# Altium schematic sheet 601_PCIe-USB.SchDoc: PCIE to USB Hub
size A2; Organization: Greenfield Tech Solutions; Address1: Molendreef 33; Address2: Ossendrecht; Address3: 4641CS; Address4: The Netherlands; SheetNumber: 7; SheetTotal: 8
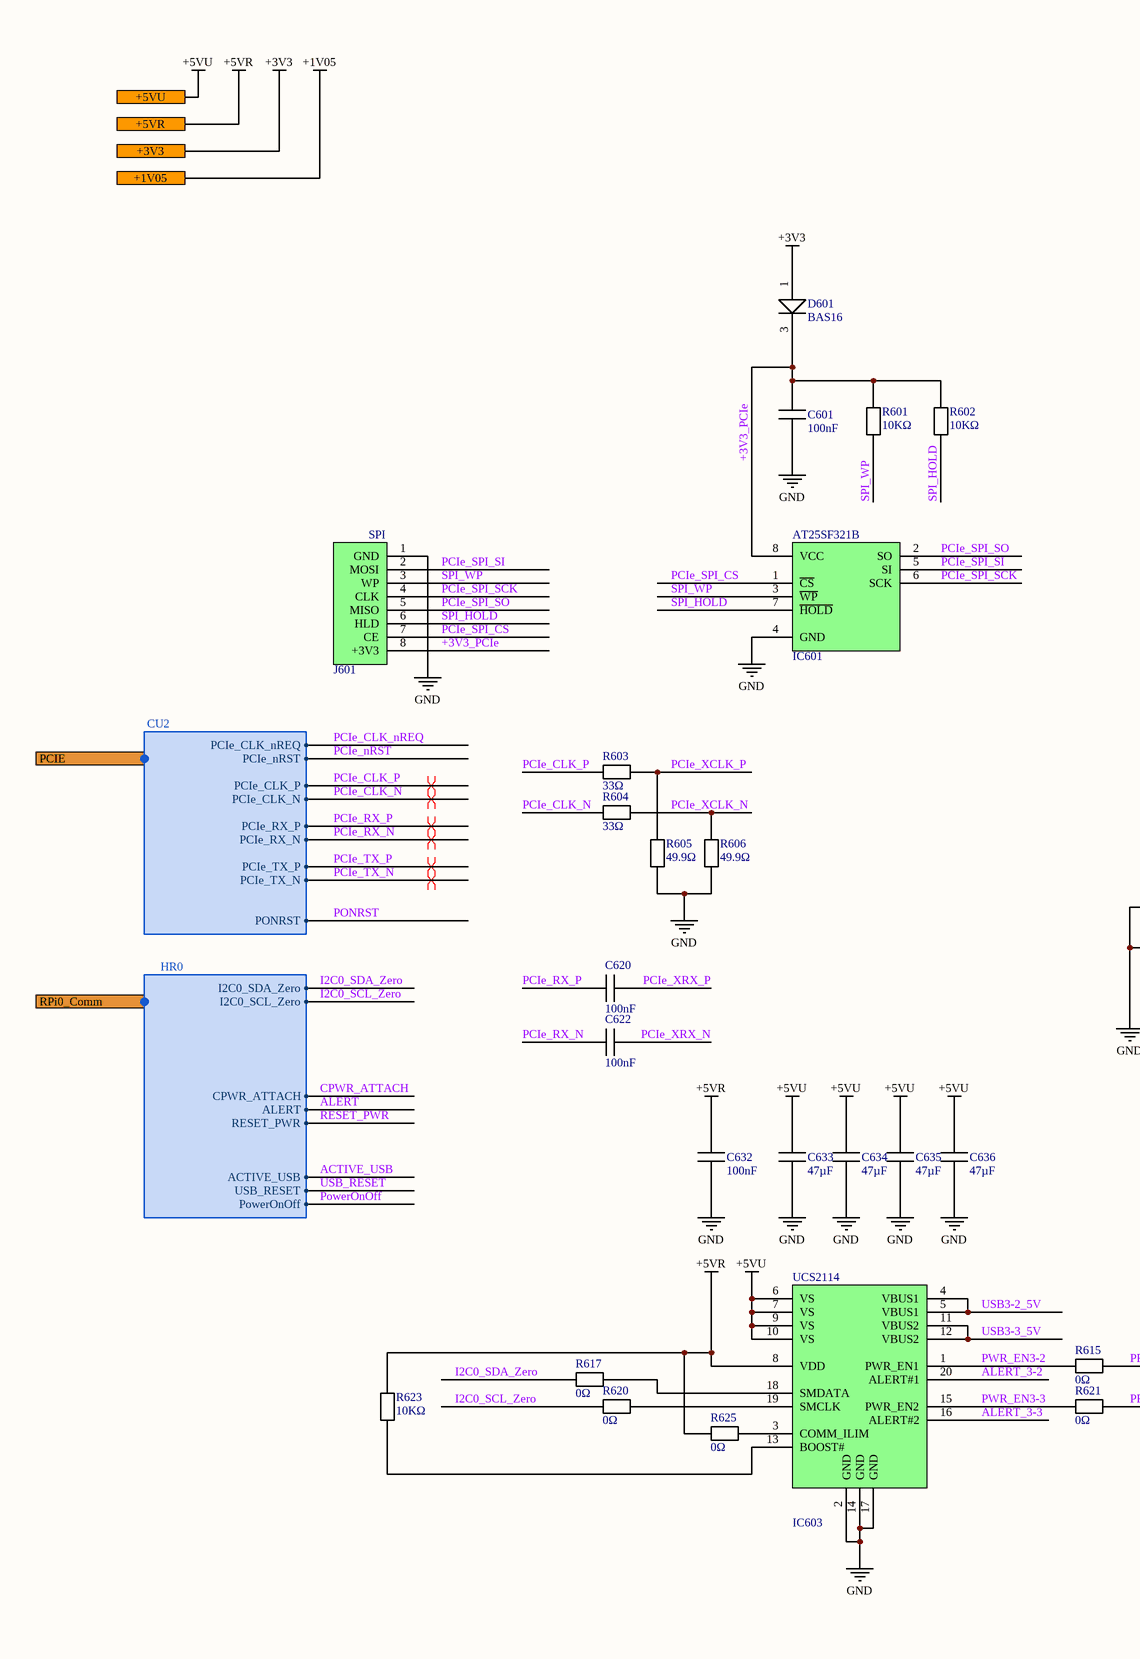
[diagram p0: 601_PCIe-USB.SchDoc, left]
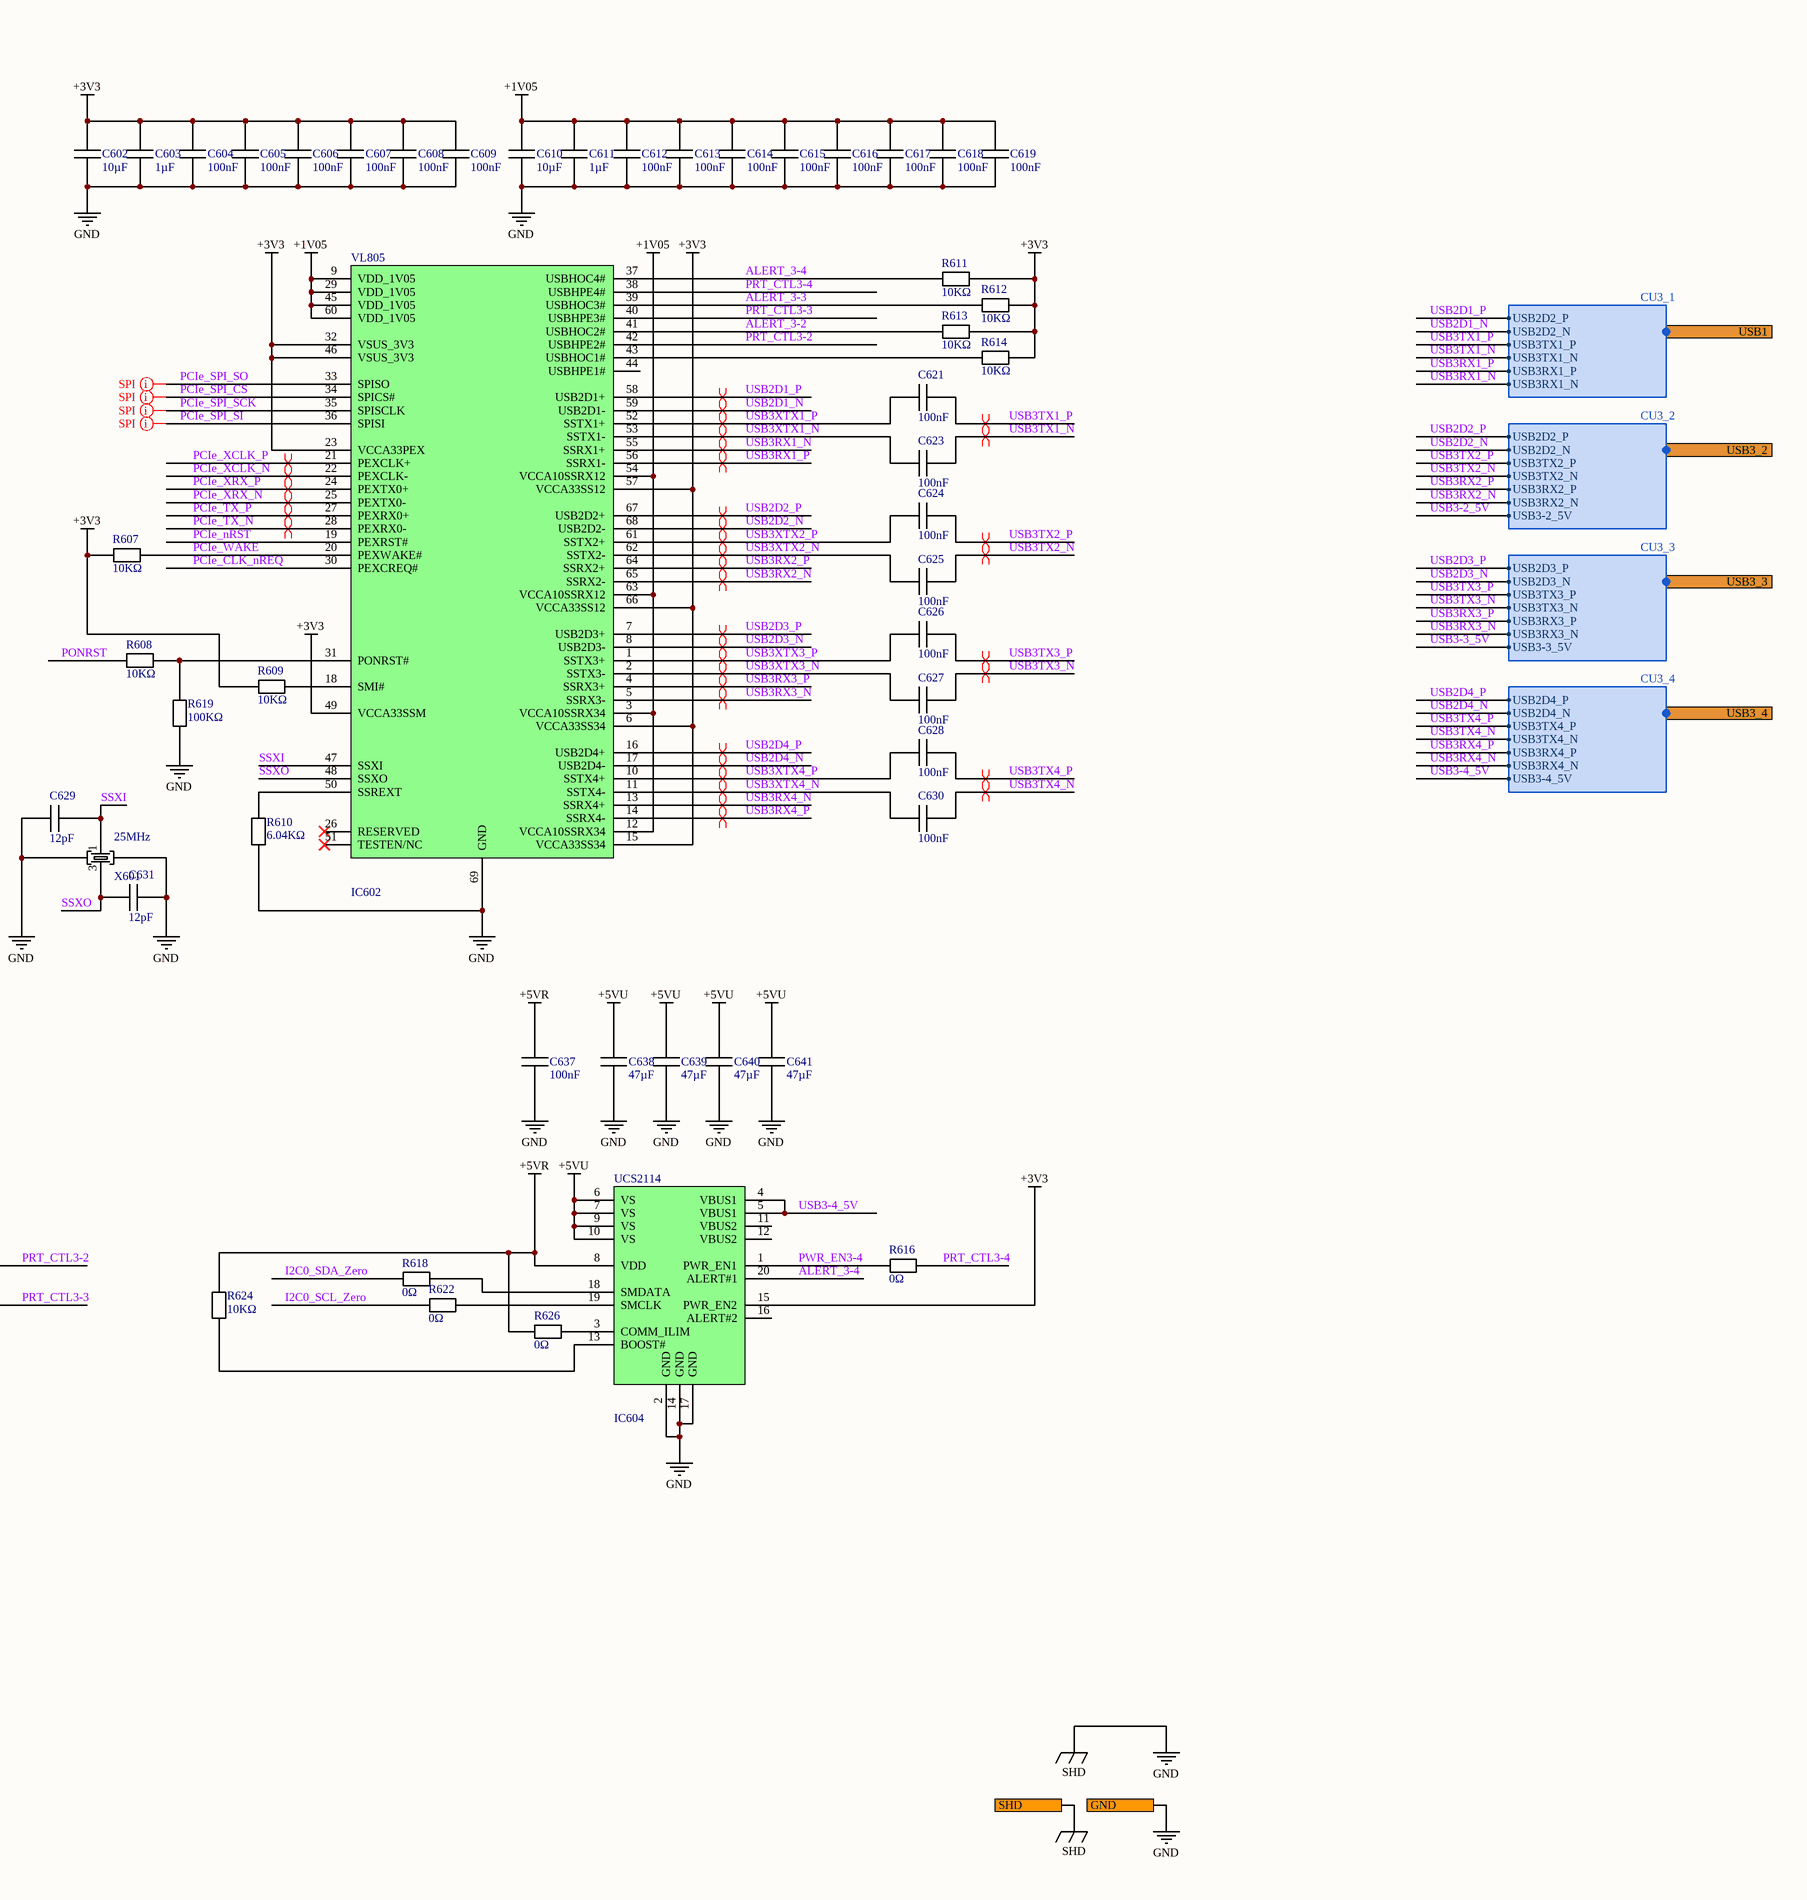
[diagram p1: 601_PCIe-USB.SchDoc, right]

## Parts
C601  100nF  [C0402]
C602  10µF  [C0603]
C603  1µF  [C0603]
C604  100nF  [C0402]
C605  100nF  [C0402]
C606  100nF  [C0402]
C607  100nF  [C0402]
C608  100nF  [C0402]
C609  100nF  [C0402]
C610  10µF  [C0603]
C611  1µF  [C0603]
C612  100nF  [C0402]
C613  100nF  [C0402]
C614  100nF  [C0402]
C615  100nF  [C0402]
C616  100nF  [C0402]
C617  100nF  [C0402]
C618  100nF  [C0402]
C619  100nF  [C0402]
C620  100nF  [C0402]
C621  100nF  [C0402]
C622  100nF  [C0402]
C623  100nF  [C0402]
C624  100nF  [C0402]
C625  100nF  [C0402]
C626  100nF  [C0402]
C627  100nF  [C0402]
C628  100nF  [C0402]
C629  12pF  [C0402]
C630  100nF  [C0402]
C631  12pF  [C0402]
C632  100nF  [C0402]
C633  47µF  [C1210]
C634  47µF  [C1210]
C635  47µF  [C1210]
C636  47µF  [C1210]
C637  100nF  [C0402]
C638  47µF  [C1210]
C639  47µF  [C1210]
C640  47µF  [C1210]
C641  47µF  [C1210]
D601  BAS16  [SOT-23]
IC601  AT25SF321B  [SO-8]
IC602  VL805  [QFN-68G_8X8]
IC603  UCS2114  [VQFN-20_3X3]
IC604  UCS2114  [VQFN-20_3X3]
J601  SPI  [SPI_PROG_TYPE1]
R601  10KΩ  [R0402]
R602  10KΩ  [R0402]
R603  33Ω  [R0201]
R604  33Ω  [R0201]
R605  49.9Ω  [R0201]
R606  49.9Ω  [R0201]
R607  10KΩ  [R0402]
R608  10KΩ  [R0402]
R609  10KΩ  [R0402]
R610  6.04KΩ  [R0402]
R611  10KΩ  [R0402]
R612  10KΩ  [R0402]
R613  10KΩ  [R0402]
R614  10KΩ  [R0402]
R615  0Ω  [R0402]
R616  0Ω  [R0402]
R617  0Ω  [R0402]
R618  0Ω  [R0402]
R619  100KΩ  [R0402]
R620  0Ω  [R0402]
R621  0Ω  [R0402]
R622  0Ω  [R0402]
R623  10KΩ  [R0402]
R624  10KΩ  [R0402]
R625  0Ω  [R0402]
R626  0Ω  [R0402]
X601  25MHz  [403W]

## Ports
+1V05, +3V3, +5VR, +5VU, GND, PCIE (harness CU2), RPi0_Comm (harness HR0), SHD, USB1 (harness CU3_1), USB3_2 (harness CU3_2), USB3_3 (harness CU3_3), USB3_4 (harness CU3_4)

## Harnesses
CU2: PCIe_nRST, PCIe_CLK_nREQ, PCIe_CLK_N, PCIe_CLK_P, PCIe_RX_N, PCIe_RX_P, PCIe_TX_N, PCIe_TX_P, PONRST
CU3_1: USB2D2_N, USB2D2_P, USB3TX1_N, USB3TX1_P, USB3RX1_N, USB3RX1_P
CU3_2: USB2D2_N, USB2D2_P, USB3TX2_N, USB3TX2_P, USB3RX2_N, USB3RX2_P, USB3-2_5V
CU3_3: USB2D3_N, USB2D3_P, USB3TX3_N, USB3TX3_P, USB3RX3_N, USB3RX3_P, USB3-3_5V
CU3_4: USB2D4_N, USB2D4_P, USB3TX4_N, USB3TX4_P, USB3RX4_N, USB3RX4_P, USB3-4_5V
HR0: I2C0_SCL_Zero, I2C0_SDA_Zero, CPWR_ATTACH, PowerOnOff, USB_RESET, ACTIVE_USB, ALERT, RESET_PWR

## Nets
+1V05: C610.1 C611.1 C612.1 C613.1 C614.1 C615.1 C616.1 C617.1 C618.1 C619.1 IC602.3(VCCA10SSRX34) IC602.9(VDD_1V05) IC602.12(VCCA10SSRX34) IC602.29(VDD_1V05) IC602.45(VDD_1V05) IC602.54(VCCA10SSRX12) IC602.60(VDD_1V05) IC602.63(VCCA10SSRX12) ; port +1V05
+3V3: C602.1 C603.1 C604.1 C605.1 C606.1 C607.1 C608.1 C609.1 D601.1(A) IC602.6(VCCA33SS34) IC602.15(VCCA33SS34) IC602.23(VCCA33PEX) IC602.32(VSUS_3V3) IC602.46(VSUS_3V3) IC602.49(VCCA33SSM) IC602.57(VCCA33SS12) IC602.66(VCCA33SS12) IC604.15(PWR_EN2) R607.2 R609.1 R611.1 R612.1 R613.1 R614.1 ; port +3V3
+5VR: C632.1 C637.1 IC603.8(VDD) IC604.8(VDD) R623.2 R624.2 R625.1 R626.1 ; port +5VR
+5VU: C633.1 C634.1 C635.1 C636.1 C638.1 C639.1 C640.1 C641.1 IC603.6(VS) IC603.7(VS) IC603.9(VS) IC603.10(VS) IC604.6(VS) IC604.7(VS) IC604.9(VS) IC604.10(VS) ; port +5VU
GND: C601.2 C602.2 C603.2 C604.2 C605.2 C606.2 C607.2 C608.2 C609.2 C610.2 C611.2 C612.2 C613.2 C614.2 C615.2 C616.2 C617.2 C618.2 C619.2 C629.1 C631.2 C632.2 C633.2 C634.2 C635.2 C636.2 C637.2 C638.2 C639.2 C640.2 C641.2 IC601.4(GND) IC602.69(GND) IC603.2(GND) IC603.14(GND) IC603.17(GND) IC604.2(GND) IC604.14(GND) IC604.17(GND) J601.1(GND) R605.1 R606.1 R610.1 R619.1 X601.2 X601.4 ; port GND, port SHD  [also labelled SHD]
+3V3_PCIe: C601.1 D601.3(K) IC601.8(VCC) J601.8(+3V3) R601.1 R602.1
ACTIVE_USB: port RPi0_Comm.ACTIVE_USB
ALERT: port RPi0_Comm.ALERT
ALERT_3-2: IC602.41(USBHOC2#) IC603.20(ALERT#1) R613.2
ALERT_3-3: IC602.39(USBHOC3#) IC603.16(ALERT#2) R612.2
ALERT_3-4: IC602.37(USBHOC4#) IC604.20(ALERT#1) R611.2
CPWR_ATTACH: port RPi0_Comm.CPWR_ATTACH
I2C0_SCL_Zero: R620.1 R622.1 ; port RPi0_Comm.I2C0_SCL_Zero
I2C0_SDA_Zero: R617.1 R618.1 ; port RPi0_Comm.I2C0_SDA_Zero
PCIe_CLK_N: R604.1 ; port PCIE.PCIe_CLK_N
PCIe_CLK_nREQ: IC602.30(PEXCREQ#) ; port PCIE.PCIe_CLK_nREQ
PCIe_CLK_P: R603.1 ; port PCIE.PCIe_CLK_P
PCIe_nRST: IC602.19(PEXRST#) ; port PCIE.PCIe_nRST
PCIe_RX_N: C622.1 ; port PCIE.PCIe_RX_N
PCIe_RX_P: C620.1 ; port PCIE.PCIe_RX_P
PCIe_SPI_CS: IC601.1(~{CS}) IC602.34(SPICS#) J601.7(CE)
PCIe_SPI_SCK: IC601.6(SCK) IC602.35(SPISCLK) J601.4(CLK)
PCIe_SPI_SI: IC601.5(SI) IC602.36(SPISI) J601.2(MOSI)
PCIe_SPI_SO: IC601.2(SO) IC602.33(SPISO) J601.5(MISO)
PCIe_TX_N: IC602.28(PEXRX0-) ; port PCIE.PCIe_TX_N
PCIe_TX_P: IC602.27(PEXRX0+) ; port PCIE.PCIe_TX_P
PCIe_WAKE: IC602.20(PEXWAKE#) R607.1
PCIe_XCLK_N: IC602.22(PEXCLK-) R604.2 R606.2
PCIe_XCLK_P: IC602.21(PEXCLK+) R603.2 R605.2
PCIe_XRX_N: C622.2 IC602.25(PEXTX0-)
PCIe_XRX_P: C620.2 IC602.24(PEXTX0+)
PONRST: R608.2 ; port PCIE.PONRST
PowerOnOff: port RPi0_Comm.PowerOnOff
PRT_CTL3-2: IC602.42(USBHPE2#) R615.2
PRT_CTL3-3: IC602.40(USBHPE3#) R621.2
PRT_CTL3-4: IC602.38(USBHPE4#) R616.2
PWR_EN3-2: IC603.1(PWR_EN1) R615.1
PWR_EN3-3: IC603.15(PWR_EN2) R621.1
PWR_EN3-4: IC604.1(PWR_EN1) R616.1
RESET_PWR: port RPi0_Comm.RESET_PWR
SPI_HOLD: IC601.7(~{HOLD}) J601.6(HLD) R602.2
SPI_WP: IC601.3(~{WP}) J601.3(WP) R601.2
SSXI: C629.2 IC602.47(SSXI) X601.1
SSXO: C631.1 IC602.48(SSXO) X601.3
USB2D1_N: IC602.59(USB2D1-) ; port USB1.USB2D2_N
USB2D1_P: IC602.58(USB2D1+) ; port USB1.USB2D2_P
USB2D2_N: IC602.68(USB2D2-) ; port USB3_2.USB2D2_N
USB2D2_P: IC602.67(USB2D2+) ; port USB3_2.USB2D2_P
USB2D3_N: IC602.8(USB2D3-) ; port USB3_3.USB2D3_N
USB2D3_P: IC602.7(USB2D3+) ; port USB3_3.USB2D3_P
USB2D4_N: IC602.17(USB2D4-) ; port USB3_4.USB2D4_N
USB2D4_P: IC602.16(USB2D4+) ; port USB3_4.USB2D4_P
USB3-2_5V: IC603.4(VBUS1) IC603.5(VBUS1) ; port USB3_2.USB3-2_5V
USB3-3_5V: IC603.11(VBUS2) IC603.12(VBUS2) ; port USB3_3.USB3-3_5V
USB3-4_5V: IC604.4(VBUS1) IC604.5(VBUS1) ; port USB3_4.USB3-4_5V
USB3RX1_N: IC602.55(SSRX1+) ; port USB1.USB3RX1_N
USB3RX1_P: IC602.56(SSRX1-) ; port USB1.USB3RX1_P
USB3RX2_N: IC602.65(SSRX2-) ; port USB3_2.USB3RX2_N
USB3RX2_P: IC602.64(SSRX2+) ; port USB3_2.USB3RX2_P
USB3RX3_N: IC602.5(SSRX3-) ; port USB3_3.USB3RX3_N
USB3RX3_P: IC602.4(SSRX3+) ; port USB3_3.USB3RX3_P
USB3RX4_N: IC602.13(SSRX4+) ; port USB3_4.USB3RX4_N
USB3RX4_P: IC602.14(SSRX4-) ; port USB3_4.USB3RX4_P
USB3TX1_N: C623.2 ; port USB1.USB3TX1_N
USB3TX1_P: C621.2 ; port USB1.USB3TX1_P
USB3TX2_N: C625.2 ; port USB3_2.USB3TX2_N
USB3TX2_P: C624.2 ; port USB3_2.USB3TX2_P
USB3TX3_N: C627.2 ; port USB3_3.USB3TX3_N
USB3TX3_P: C626.2 ; port USB3_3.USB3TX3_P
USB3TX4_N: C630.2 ; port USB3_4.USB3TX4_N
USB3TX4_P: C628.2 ; port USB3_4.USB3TX4_P
USB3XTX1_N: C623.1 IC602.53(SSTX1-)
USB3XTX1_P: C621.1 IC602.52(SSTX1+)
USB3XTX2_N: C625.1 IC602.62(SSTX2-)
USB3XTX2_P: C624.1 IC602.61(SSTX2+)
USB3XTX3_N: C627.1 IC602.2(SSTX3-)
USB3XTX3_P: C626.1 IC602.1(SSTX3+)
USB3XTX4_N: C630.1 IC602.11(SSTX4-)
USB3XTX4_P: C628.1 IC602.10(SSTX4+)
USB_RESET: port RPi0_Comm.USB_RESET
NetIC602_18: IC602.18(SMI#) R609.2
NetIC602_31: IC602.31(PONRST#) R608.1 R619.2
NetIC602_43: IC602.43(USBHOC1#) R614.2
NetIC602_50: IC602.50(SSREXT) R610.2
NetIC603_3: IC603.3(COMM_ILIM) R625.2
NetIC603_13: IC603.13(BOOST#) R623.1
NetIC603_18: IC603.18(SMDATA) R617.2
NetIC603_19: IC603.19(SMCLK) R620.2
NetIC604_3: IC604.3(COMM_ILIM) R626.2
NetIC604_13: IC604.13(BOOST#) R624.1
NetIC604_18: IC604.18(SMDATA) R618.2
NetIC604_19: IC604.19(SMCLK) R622.2

Not connected (* = marked no-connect by the designer): IC602 26(RESERVED)* 44(USBHPE1#) 51(TESTEN/NC)*; IC604 11(VBUS2) 12(VBUS2) 16(ALERT#2)

## Layout directives
differential pair; differential pair class PCIE: PCIe_CLK_N, PCIe_CLK_P, PCIe_RX_N, PCIe_RX_P, PCIe_TX_N, PCIe_TX_P, PCIe_XCLK_N, PCIe_XCLK_P, PCIe_XRX_N, PCIe_XRX_P
differential pair; differential pair class USB3: USB2D1_N, USB2D1_P, USB2D2_N, USB2D2_P, USB2D3_N, USB2D3_P, USB2D4_N, USB2D4_P, USB3RX1_N, USB3RX1_P, USB3RX2_N, USB3RX2_P, USB3RX3_N, USB3RX3_P, USB3RX4_N, USB3RX4_P, USB3TX1_N, USB3TX1_P, USB3TX2_N, USB3TX2_P, USB3TX3_N, USB3TX3_P, USB3TX4_N, USB3TX4_P, USB3XTX1_N, USB3XTX1_P, USB3XTX2_N, USB3XTX2_P, USB3XTX3_N, USB3XTX3_P, USB3XTX4_N, USB3XTX4_P
net class SPI_VL805: PCIe_SPI_CS, PCIe_SPI_SCK, PCIe_SPI_SI, PCIe_SPI_SO

## Notes on the sheet
- Title
- Size:
- Date:
- File:
- A2
- Number:
- Time:
- Revision:
- Sheet
- of

## Library data of the parts
C601 C604-C609 C612-C628 C630 C632 C637 = CA0010: 100nF 16V 10% X7R; Part Number: CA0010; ManfactPart: GCM155R71C104KA55D; ID: 10; RefVal: 100nF
C602 C610 = CA0008: 10µF 16V 20% X5R; Part Number: CA0008; ManfactPart: GRM188R61C106MAALD; ID: 8; RefVal: 10µF
C603 C611 = CA0003: 1µF 16V 10% X5R; Part Number: CA0003; ManfactPart: C1608X5R1C105K080AA; ID: 3; RefVal: 1µF
C629 C631 = CA0059: 12pF 16V 1% C0G; Part Number: CA0059; ManfactPart: VJ0402A120FXJCW1BC; ID: 59; RefVal: 12pF
C633-C636 C638-C641 = CA0007: 47µF 16V 20% X5R; Part Number: CA0007; ManfactPart: EMK325ABJ476MM8P; ID: 7; RefVal: 47µF
D601 = DI0010: Diodes - General Purpose, Power, Switching 100Vll Signal Switching Diodes 2A; Part Number: DI0010; ManfactPart: BAS16_R1_00001; ID: 10; RefVal: BAS16
IC601 = IC0053: 32-Mbit SPI Serial Flash Memory with Dual-I/O and Quad-I/O Support; Part Number: IC0053; ManfactPart: AT25SF321B-SSHB-T; ID: 53; RefVal: AT25SF321B
IC602 = IC0046: VL805 4-Port USB 3.0 Host Controller; Part Number: IC0046; ManfactPart: VL805-Q6; ID: 46; RefVal: VL805
IC603 IC604 = IC0056: Dual USB Power Switch with Integrated Current Sensor; Part Number: IC0056; ID: 56; RefVal: UCS2114; ManfactPart: UCS2114
J601 = ME0028: SPI Programming connection; Part Number: ME0028; ID: 28; RefVal: SPI
R601 R602 R607-R609 R611-R614 R623 R624 = RS0011: 10KΩ 1% 62.5mW; Part Number: RS0011; ManfactPart: WR04X1002FTL; ID: 11; RefVal: 10KΩ
R603 R604 = RS0067: 33Ω 5% 50mW 200PPM; Part Number: RS0067; ManfactPart: 0201WMJ0330TEE; ID: 67; RefVal: 33Ω
R605 R606 = RS0069: 49.9Ω 1% 50mW 200PPM; Part Number: RS0069; ManfactPart: 0201WMF499JTEE; ID: 69; RefVal: 49.9Ω
R610 = RS0017: 6.04KΩ 1% 62.5mW; Part Number: RS0017; ManfactPart: RC0402FR-076K04L; ID: 17; RefVal: 6.04KΩ
R615-R618 R620-R622 R625 R626 = RS0074: 0Ω 62.5mW; Part Number: RS0074; ManfactPart: 0402WGJ0000TCE; ID: 74; RefVal: 0Ω
R619 = RS0036: 100KΩ 1% 62.5mW 100PPM; Part Number: RS0036; ManfactPart: AC0402FR-13100KL; ID: 36; RefVal: 100KΩ
X601 = CR0003: 25MHz 8pF 20PPM; Part Number: CR0003; ManfactPart: 403WF25012IK; ID: 3; RefVal: 25MHz